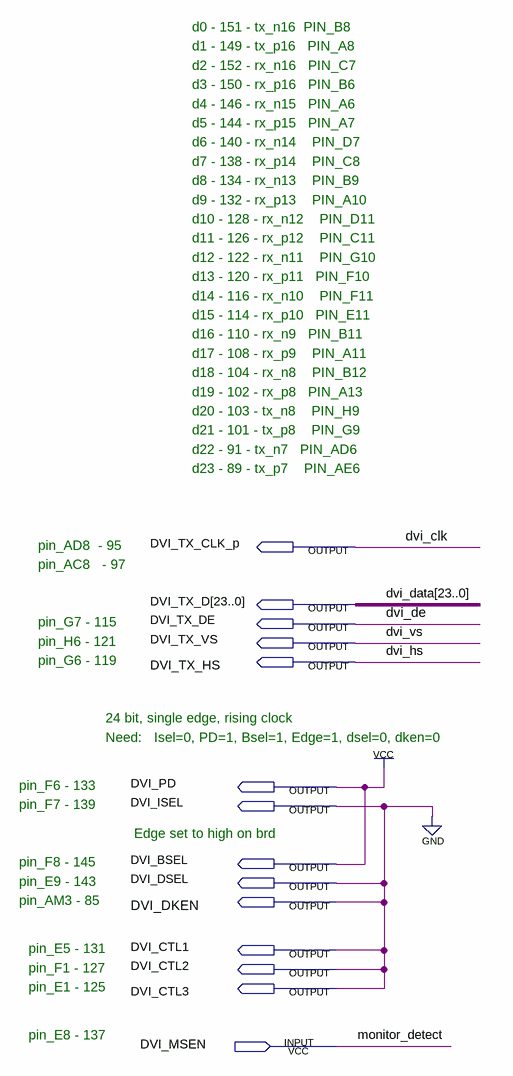
[diagram p0: schematic sheet]
// Quartus schematic dvi_connector_pinout.bdf as structural Verilog: 0 symbols, 14 pins
module dvi_connector_pinout (
  input  DVI_MSEN,
  output DVI_TX_CLK_p,
  output [23:0] DVI_TX_D,
  output DVI_TX_DE,
  output DVI_TX_VS,
  output DVI_TX_HS,
  output DVI_PD,
  output DVI_ISEL,
  output DVI_BSEL,
  output DVI_DSEL,
  output DVI_DKEN,
  output DVI_CTL1,
  output DVI_CTL2,
  output DVI_CTL3
);


  assign DVI_BSEL = 1'b1;
  assign DVI_CTL1 = 1'b0;
  assign DVI_CTL2 = 1'b0;
  assign DVI_CTL3 = 1'b0;
  assign DVI_DKEN = 1'b0;
  assign DVI_DSEL = 1'b0;
  assign DVI_ISEL = 1'b0;
  assign DVI_PD = 1'b1;

  // Other names for the same wires on the sheet: dvi_clk = DVI_TX_CLK_p; dvi_data[23:0] = DVI_TX_D;
  //   dvi_de = DVI_TX_DE; dvi_hs = DVI_TX_HS; dvi_vs = DVI_TX_VS; monitor_detect = DVI_MSEN

  // Notes on the sheet:
  //   d0 - 151 - tx_n16  PIN_B8
  //   d1 - 149 - tx_p16   PIN_A8
  //   d2 - 152 - rx_n16   PIN_C7
  //   d3 - 150 - rx_p16   PIN_B6
  //   d4 - 146 - rx_n15   PIN_A6
  //   d5 - 144 - rx_p15   PIN_A7
  //   d6 - 140 - rx_n14    PIN_D7
  //   d7 - 138 - rx_p14    PIN_C8
  //   d8 - 134 - rx_n13    PIN_B9
  //   d9 - 132 - rx_p13    PIN_A10
  //   d10 - 128 - rx_n12    PIN_D11
  //   d11 - 126 - rx_p12    PIN_C11
  //   d12 - 122 - rx_n11    PIN_G10
  //   d13 - 120 - rx_p11   PIN_F10
  //   d14 - 116 - rx_n10    PIN_F11
  //   d15 - 114 - rx_p10   PIN_E11
  //   d16 - 110 - rx_n9   PIN_B11
  //   d17 - 108 - rx_p9    PIN_A11
  //   d18 - 104 - rx_n8    PIN_B12
  //   d19 - 102 - rx_p8   PIN_A13
  //   d20 - 103 - tx_n8    PIN_H9
  //   d21 - 101 - tx_p8    PIN_G9
  //   d22 - 91 - tx_n7   PIN_AD6
  //   d23 - 89 - tx_p7    PIN_AE6
  //   pin_AD8  - 95
  //   pin_AC8   - 97
  //   pin_G7 - 115
  //   pin_H6 - 121
  //   pin_G6 - 119
  //   24 bit, single edge, rising clock
  //   Need:   Isel=0, PD=1, Bsel=1, Edge=1, dsel=0, dken=0 
  //   pin_F6 - 133
  //   pin_F7 - 139
  //   Edge set to high on brd
  //   pin_F8 - 145
  //   pin_E9 - 143
  //   pin_AM3 - 85
  //   pin_E5 - 131
  //   pin_F1 - 127
  //   pin_E1 - 125
  //   pin_E8 - 137
endmodule
